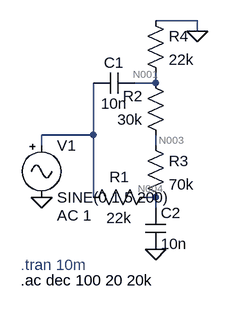
[diagram p0: schematic tone_control.asc]
tone_control.asc, the LTspice schematic file:
Version 4
SHEET 1 880 680
WIRE 256 80 192 80
WIRE 256 96 256 80
WIRE 192 176 192 160
WIRE 192 176 160 176
WIRE 96 256 96 176
WIRE 96 256 16 256
WIRE 16 272 16 256
WIRE 192 272 192 256
WIRE 96 352 96 256
WIRE 192 352 176 352
WIRE 192 368 192 352
FLAG 256 96 0
FLAG 192 432 0
FLAG 16 352 0
SYMBOL cap 160 160 R90
WINDOW 0 0 32 VBottom 2
WINDOW 3 32 32 VTop 2
SYMATTR InstName C1
SYMATTR Value 10n
SYMBOL res 192 336 R90
WINDOW 0 0 56 VBottom 2
WINDOW 3 32 56 VTop 2
SYMATTR InstName R1
SYMATTR Value 22k
SYMBOL res 208 272 R180
WINDOW 0 36 76 Left 2
WINDOW 3 36 40 Left 2
SYMATTR InstName R2
SYMATTR Value 30k
SYMBOL res 176 256 R0
SYMATTR InstName R3
SYMATTR Value 70k
SYMBOL res 176 64 R0
SYMATTR InstName R4
SYMATTR Value 22k
SYMBOL cap 176 368 R0
SYMATTR InstName C2
SYMATTR Value 10n
SYMBOL Misc\\signal 16 256 R0
WINDOW 123 24 124 Left 2
WINDOW 39 0 0 Left 0
SYMATTR InstName V1
SYMATTR Value SINE(0 1.5 200)
SYMATTR Value2 AC 1
TEXT -16 456 Left 2 ;.tran 10m
TEXT -16 480 Left 2 !.ac dec 100 20 20k

The netlist it stands for:
* tone_control.asc
C1 N001 N002 10n
R1 N004 N002 22k
R2 N003 N001 30k
R3 N003 N004 70k
R4 0 N001 22k
C2 N004 0 10n
V1 N002 0 SINE(0 1.5 200) AC 1
* .tran 10m
.ac dec 100 20 20k
.backanno
.end

* Results of the author's LTspice run, read from the files saved beside the schematic
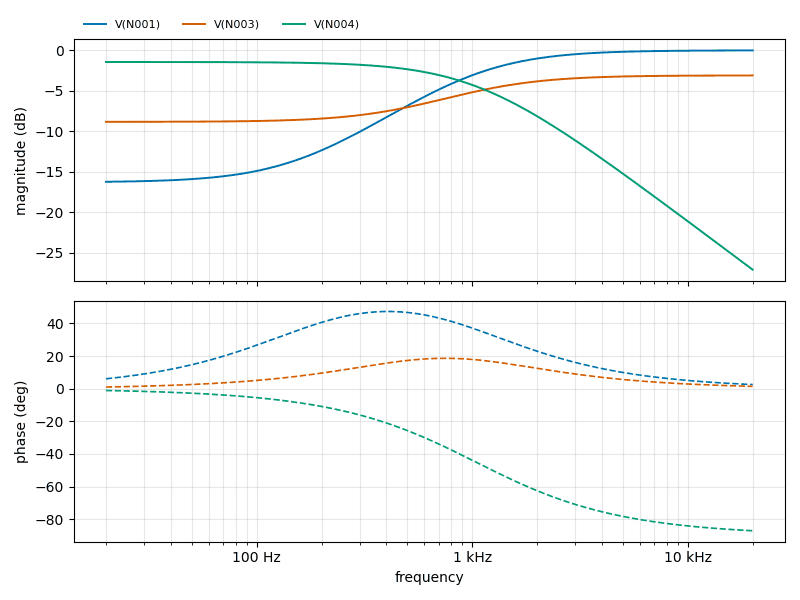
[diagram p1: AC Analysis of tone_control.asc, plotted from the saved traces]
* AC Analysis, 1 run:
*   V(N001): -16.25 dB at 20 Hz, -0.01 dB at 20 kHz, peak -0.01 dB at 20 kHz, 3 dB below the peak at 1.014 kHz
*   V(N003): -8.84 dB at 20 Hz, -3.11 dB at 20 kHz, peak -3.11 dB at 20 kHz, 3 dB below the peak at 710.3 Hz
*   V(N004): -1.44 dB at 20 Hz, -27.12 dB at 20 kHz, peak -1.44 dB at 20 Hz, 3 dB below the peak at 1.042 kHz